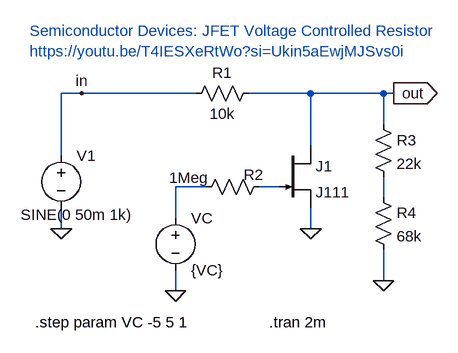
[diagram p0: schematic 01-j111_voltage_controlled_resistor.asc]
01-j111_voltage_controlled_resistor.asc, the LTspice schematic file:
Version 4
SHEET 1 880 680
WIRE -208 48 -240 48
WIRE -32 48 -208 48
WIRE 144 48 48 48
WIRE 256 48 144 48
WIRE 272 48 256 48
WIRE 256 96 256 48
WIRE 144 128 144 48
WIRE -240 144 -240 48
WIRE -16 192 -64 192
WIRE 96 192 64 192
WIRE 256 208 256 176
WIRE -64 240 -64 192
WIRE -240 256 -240 224
WIRE 144 256 144 224
WIRE 256 336 256 288
WIRE -64 352 -64 320
FLAG -64 352 0
FLAG 144 256 0
FLAG 256 336 0
FLAG -240 256 0
FLAG -208 48 in
FLAG 272 48 out
IOPIN 272 48 Out
SYMBOL njf 96 128 R0
SYMATTR InstName J1
SYMATTR Value J111
SYMBOL res 64 32 R90
WINDOW 0 0 56 VBottom 2
WINDOW 3 32 56 VTop 2
SYMATTR InstName R1
SYMATTR Value 10k
SYMBOL res 80 176 R90
WINDOW 0 13 24 VBottom 2
WINDOW 3 -14 123 VTop 2
SYMATTR InstName R2
SYMATTR Value 1Meg
SYMBOL res 240 80 R0
SYMATTR InstName R3
SYMATTR Value 22k
SYMBOL voltage -240 128 R0
WINDOW 3 -62 107 Left 2
WINDOW 123 0 0 Left 0
WINDOW 39 0 0 Left 0
SYMATTR Value SINE(0 50m 1k)
SYMATTR InstName V1
SYMBOL voltage -64 224 R0
WINDOW 123 0 0 Left 0
WINDOW 39 0 0 Left 0
SYMATTR InstName VC
SYMATTR Value {VC}
SYMBOL res 240 192 R0
SYMATTR InstName R4
SYMATTR Value 68k
TEXT -288 -48 Left 2 ;Semiconductor Devices: JFET Voltage Controlled Resistor\nhttps://youtu.be/T4IESXeRtWo?si=Ukin5aEwjMJSvs0i
TEXT 80 400 Left 2 !.tran 2m
TEXT -280 400 Left 2 !.step param VC -5 5 1

The netlist it stands for:
* 01-j111_voltage_controlled_resistor.asc
J1 out N002 0 J111
R1 out in 10k
R2 N002 N001 1Meg
R3 out N003 22k
V1 in 0 SINE(0 50m 1k)
VC N001 0 {VC}
R4 N003 0 68k
.model NJF NJF
.model PJF PJF
.lib standard.jft
* Semiconductor Devices: JFET Voltage Controlled Resistor
* https://youtu.be/T4IESXeRtWo?si=Ukin5aEwjMJSvs0i
.tran 2m
.step param VC -5 5 1
.backanno
.end

* Results of the author's LTspice run, read from the files saved beside the schematic
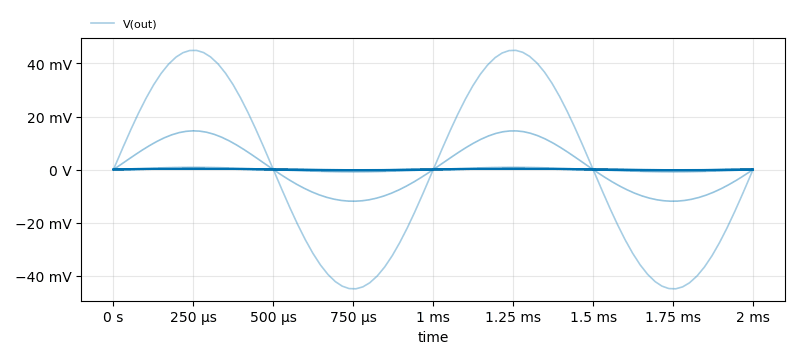
[diagram p1: Transient Analysis of 01-j111_voltage_controlled_resistor.asc, plotted from the saved traces]
* Transient Analysis, 11 runs:
*   V(out) [vc=-5]: min -44.94 mV, max 44.94 mV, average -111.4 nV, rms 31.83 mV, last -8.007 µV
*   V(out) [vc=-4]: min -11.92 mV, max 14.61 mV, average 662.4 µV, rms 9.368 mV, last -723.9 nV
*   V(out) [vc=-3]: min -814 µV, max 814.6 µV, average 150.5 nV, rms 576.8 µV, last -4.124 nV
*   V(out) [vc=-2]: min -425 µV, max 425.1 µV, average 19.73 nV, rms 301.1 µV, last -1.37 nV
*   V(out) [vc=-1]: min -289.6 µV, max 289.7 µV, average 5.574 nV, rms 205.2 µV, last -719.5 pV
*   V(out) [vc=0]: min -220.9 µV, max 220.9 µV, average 2.239 nV, rms 156.5 µV, last -378.3 pV
*   V(out) [vc=1]: min -190.6 µV, max 216.3 µV, average 12.84 µV, rms 144.6 µV, last 12.86 µV
*   V(out) [vc=2]: min -169.8 µV, max 234.7 µV, average 32.5 µV, rms 146.9 µV, last 32.55 µV